# Altium project Falling_Safety_PCB_Project.PrjPcb
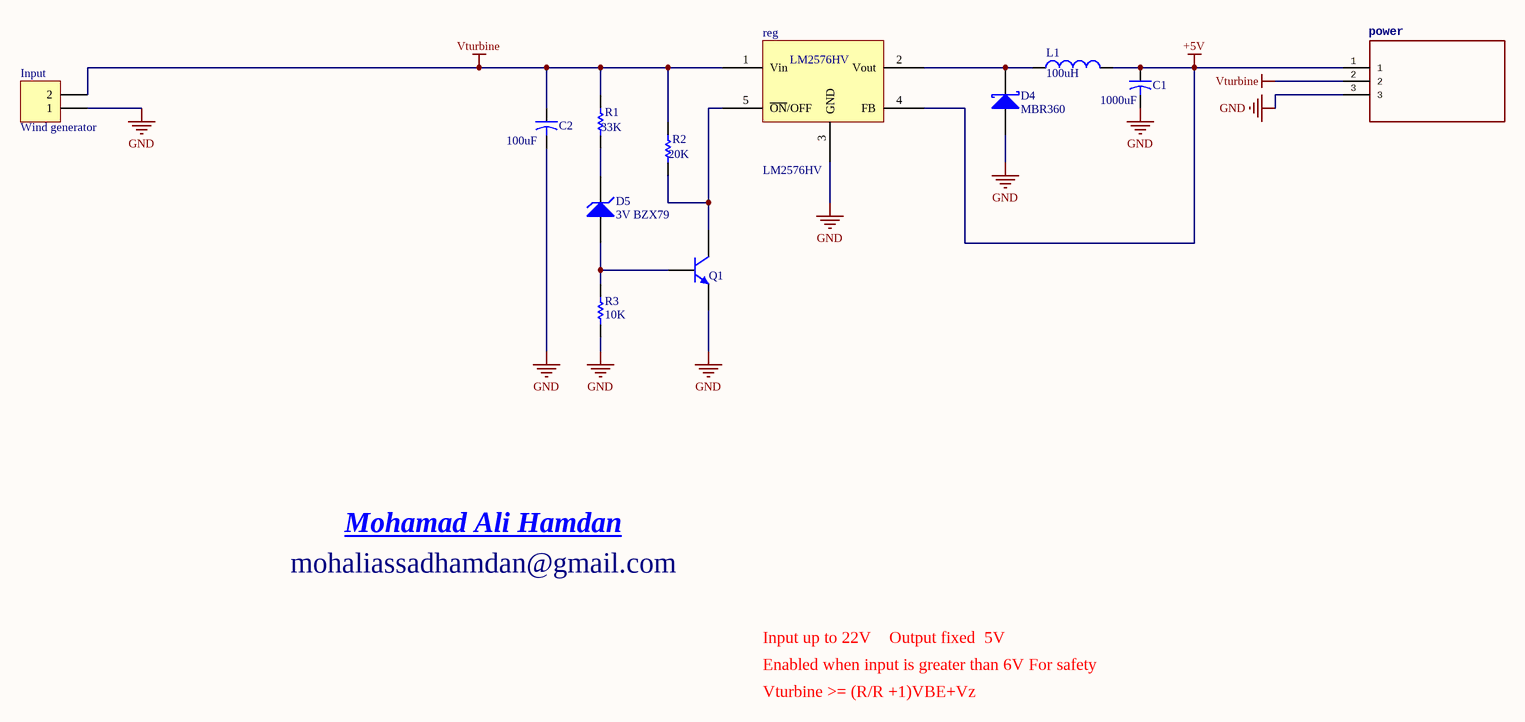
[diagram p0: Falling_safety_Sheet1.SchDoc]
1 sheet, 12 parts. Net scope: global (net labels, ports and power ports of the same name join across sheets).
Board file: Falling_safety_PCB1.PcbDoc

## Sheet Falling_safety_Sheet1.SchDoc
size A3

### Parts
C1  value 1000uF  [Capacitor_polarized_100uF]  (hidden comment: Cap2)
C2  value 100uF  [Capacitor_polarized_100uF]  (hidden comment: Cap2)
D4  MBR360  [diode 4007]
D5  3V BZX79  [diode 4007]
Input  Wind generator  [blue_connector_2pins]
L1  value 100uH  [Coil_100uH]  (hidden comment: Inductor)
power  SAMTEC-HTSW-103-07-X-SJ  [SAMTEC-HTSW-103-07-X-S]  (value not drawn)
Q1  NPN  [TO-226-AA]  (value not drawn)
R1  value 33K  [resistor]  (hidden comment: Res1)
R2  value 20K  [resistor]  (hidden comment: Res1)
R3  value 10K  [resistor]  (hidden comment: Res1)
reg  LM2576HV  [LM2576HV]

### Nets
+5V: C1.1 L1.2 power.1 reg.4(FB)
GND: C1.2 C2.2 D4.3(A) Input.1 power.3 Q1.3(E) R3.1 reg.3(GND)
Vturbine: C2.1 Input.2 power.2 R1.2 R2.2 reg.1(Vin)
NetD4_1: D4.1(K) L1.1 reg.2(Vout)
NetD5_1: D5.1(A) Q1.2(B) R3.2
NetD5_2: D5.2(K) R1.1
NetQ1_1: Q1.1(C) R2.1 reg.5(~{ON}/OFF)

### Notes on the sheet
- Mohamad Ali Hamdan
- mohaliassadhamdan@gmail.com
- Input up to 22V    Output fixed  5V
- Enabled when input is greater than 6V For safety
- Vturbine >= (R/R +1)VBE+Vz

### Library data of the parts
C1 C2 = Cap2: Capacitor; pin to pad: 1>+ 2>-; Published: 23-Sep-2002; PackageReference: CAPR5-4X5; Publisher: Altium Limited; PackageDescription: Capacitor; 2 Leads
D4 = Diode 10TQ035: Schottky Rectifier; pin to pad: 3>2; Note: Terminal 2 is the TAB and is electrically connected to the cathode; Published: 8-Jun-2000; LatestRevisionDate: 17-Jul-2002; LatestRevisionNote: Re-released for DXP Platform.; DatasheetVersion: PD-2.057B; PackageVersion: Feb-1998; PackageReference: TO-220AC; Publisher: Altium Limited; PackageDescription: TO, Thru-Hole, Vertical, Heatsink Mounted; 3 In-Line Leads (1 Absent); Pitch 2.54 mm; ComponentLink1Description: Manufacturer Link; ComponentLink1URL: http://www.irf.com/; ComponentLink2Description: Datasheet; ComponentLink2URL: http://www.irf.com/product-info/datasheets/data/10tq.pdf
D5 = D Zener: Zener Diode; Published: 8-Jun-2000; LatestRevisionDate: 17-Jul-2002; LatestRevisionNote: Re-released for DXP Platform.; PackageReference: DIODE-0.7; Publisher: Altium Limited; PackageDescription: Diode, Thru-Hole; 2 Leads; 0.7 in Pin Spacing
Input = Header 2: Header, 2-Pin; LatestRevisionDate: 17-Jul-2002; LatestRevisionNote: Re-released for DXP Platform.; Publisher: Altium Limited
L1 = Inductor: Code_IEC: 1005; Published: 8-Jun-2000; LatestRevisionDate: 29-May-2009; LatestRevisionNote: IPC-7351 Footprint Added.; PackageReference: 0402-A; Publisher: Altium Limited; PackageDescription: Chip Inductor; Code_JEITA: 0402
Q1 = NPN: NPN Bipolar Transistor; Published: 8-Jun-2000; LatestRevisionDate: 17-Jul-2002; LatestRevisionNote: Re-released for DXP Platform.; PackageReference: TO-226-AA; Publisher: Altium Limited; PackageDescription: TO, Flat Index; 3 In-Line, Axial Leads; Body Dia. 4.8mm; Leads 0.55 x 0.51 mm (max); Code_JEDEC: TO-226-AA
R1-R3 = Res1: Resistor; Published: 8-Jun-2000; LatestRevisionDate: 17-Jul-2002; LatestRevisionNote: Re-released for DXP Platform.; PackageReference: AXIAL-0.3; Publisher: Altium Limited; PackageDescription: Axial Device, Thru-Hole; 2 Leads; 0.3 in Pin Spacing
reg = LM2576HV: 3A Step-down Adjustable Output Switching Regulator with enable pin